# EAGLE schematic Keyboard (EAGLE 6.5.0)
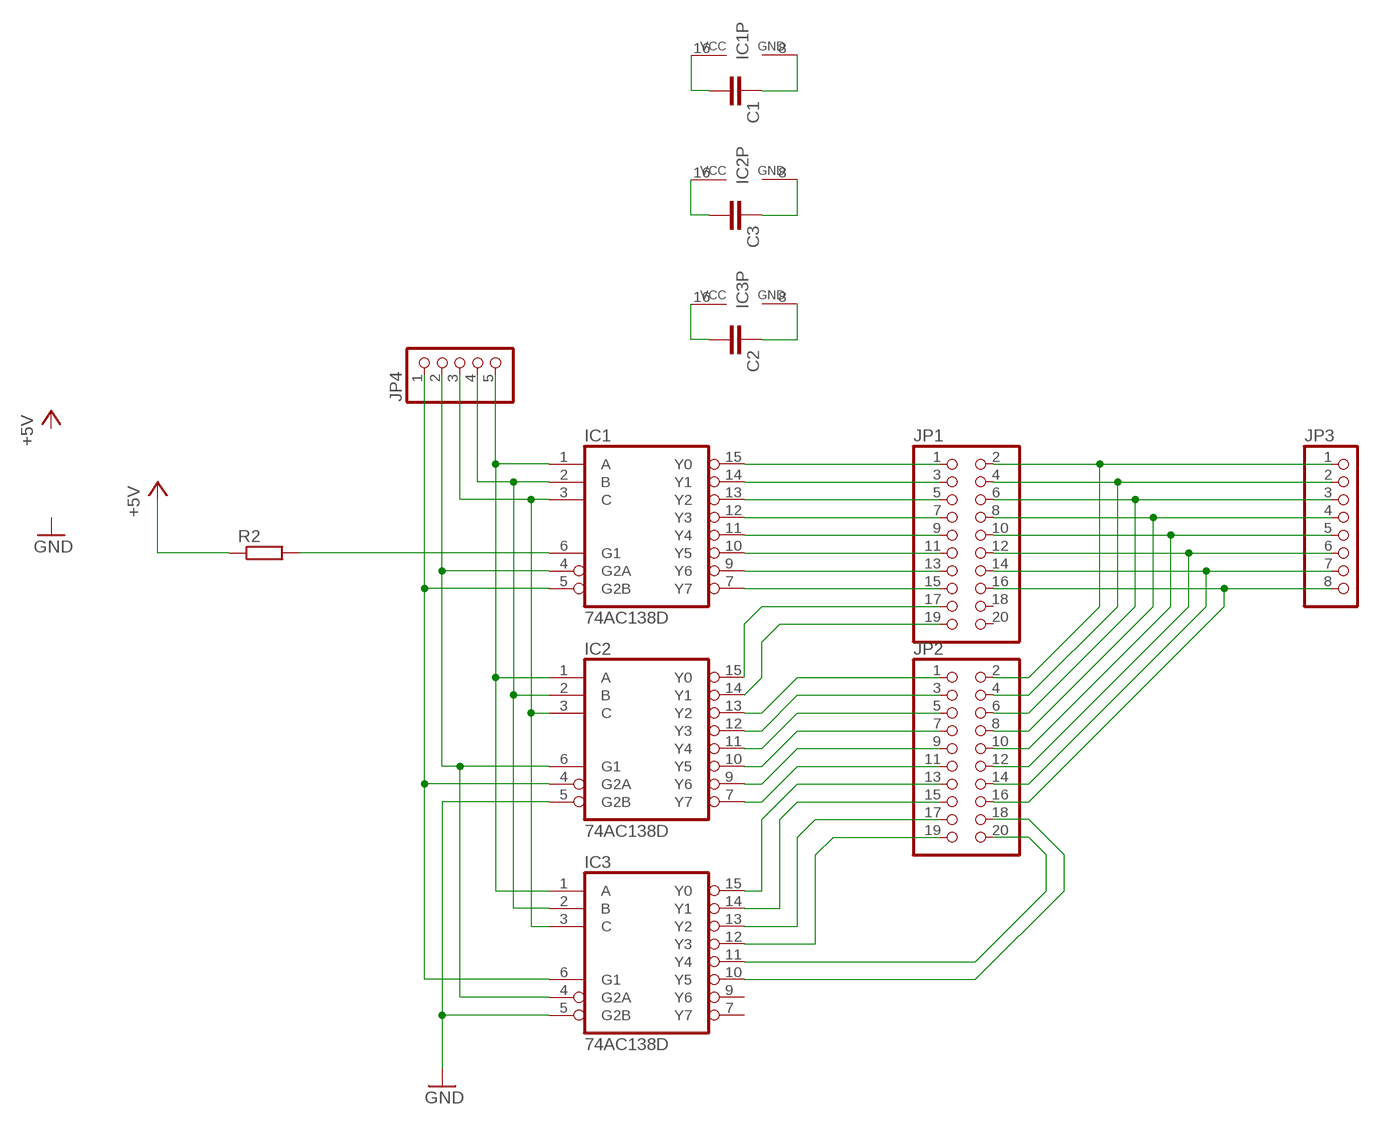
[diagram p0: schematic, sheet 1]

## Parts
C1  C-EUC3216  [C3216]
C2  C-EUC3216  [C3216]
C3  C-EUC3216  [C3216]
IC1  74AC138D  [SO16]
IC2  74AC138D  [SO16]
IC3  74AC138D  [SO16]
JP1  PINHD-2X10  [2X10]
JP2  PINHD-2X10  [2X10]
JP3  PINHD-1X8  [1X08]
JP4  PINHD-1X5  [1X05]
R2  R-EU_M3216  [M3216]

## Nets
+5V: R2.1
GND: IC2.5(G2B) IC3.5(G2B)
N$1: IC1.3(C) IC2.3(C) IC3.3(C) JP4.3
N$2: IC1.2(B) IC2.2(B) IC3.2(B) JP4.4
N$3: IC1.1(A) IC2.1(A) IC3.1(A) JP4.5
N$4: IC1.15(Y0) JP1.1
N$5: C3.1 IC2.8(GND)
N$6: C3.2 IC2.16(VCC)
N$7: C1.1 IC1.8(GND)
N$8: C2.2 IC3.16(VCC)
N$9: C2.1 IC3.8(GND)
N$10: C1.2 IC1.16(VCC)
N$11: IC1.14(Y1) JP1.3
N$12: IC1.13(Y2) JP1.5
N$13: IC1.12(Y3) JP1.7
N$14: IC1.11(Y4) JP1.9
N$15: IC1.10(Y5) JP1.11
N$16: IC1.9(Y6) JP1.13
N$17: IC1.7(Y7) JP1.15
N$18: IC2.15(Y0) JP1.17
N$19: IC2.13(Y2) JP2.1
N$20: IC2.14(Y1) JP1.19
N$21: IC2.12(Y3) JP2.3
N$22: IC2.11(Y4) JP2.5
N$23: IC2.10(Y5) JP2.7
N$24: IC2.9(Y6) JP2.9
N$25: IC2.7(Y7) JP2.11
N$26: IC3.15(Y0) JP2.13
N$27: IC3.14(Y1) JP2.15
N$28: IC3.13(Y2) JP2.17
N$29: IC3.12(Y3) JP2.19
N$30: IC3.11(Y4) JP2.20
N$31: IC3.10(Y5) JP2.18
N$32: JP1.2 JP2.2 JP3.1
N$33: JP1.4 JP2.4 JP3.2
N$34: JP1.6 JP2.6 JP3.3
N$35: JP1.8 JP2.8 JP3.4
N$36: JP1.10 JP2.10 JP3.5
N$37: JP1.12 JP2.12 JP3.6
N$38: JP1.14 JP2.14 JP3.7
N$39: JP1.16 JP2.16 JP3.8
N$40: IC1.6(G1) R2.2
N$42: IC1.4(G2A) IC2.6(G1) IC3.4(G2A) JP4.2
N$43: IC1.5(G2B) IC2.4(G2A) IC3.6(G1) JP4.1
Unconnected: IC3.7(Y7) IC3.9(Y6) JP1.18 JP1.20

## Library data of the parts
C1-C3 = rcl:C-EU: CAPACITOR, European symbol
IC1-IC3 = 74xx-eu:74*138: 3-line to 8-line DECODER/DEMULTIPLEXER
JP1 JP2 = pinhead:PINHD-2X10: PIN HEADER
JP3 = pinhead:PINHD-1X8: PIN HEADER
JP4 = pinhead:PINHD-1X5: PIN HEADER
R2 = rcl:R-EU_: RESISTOR, European symbol